# EAGLE design BMS (EAGLE 9.5.2)
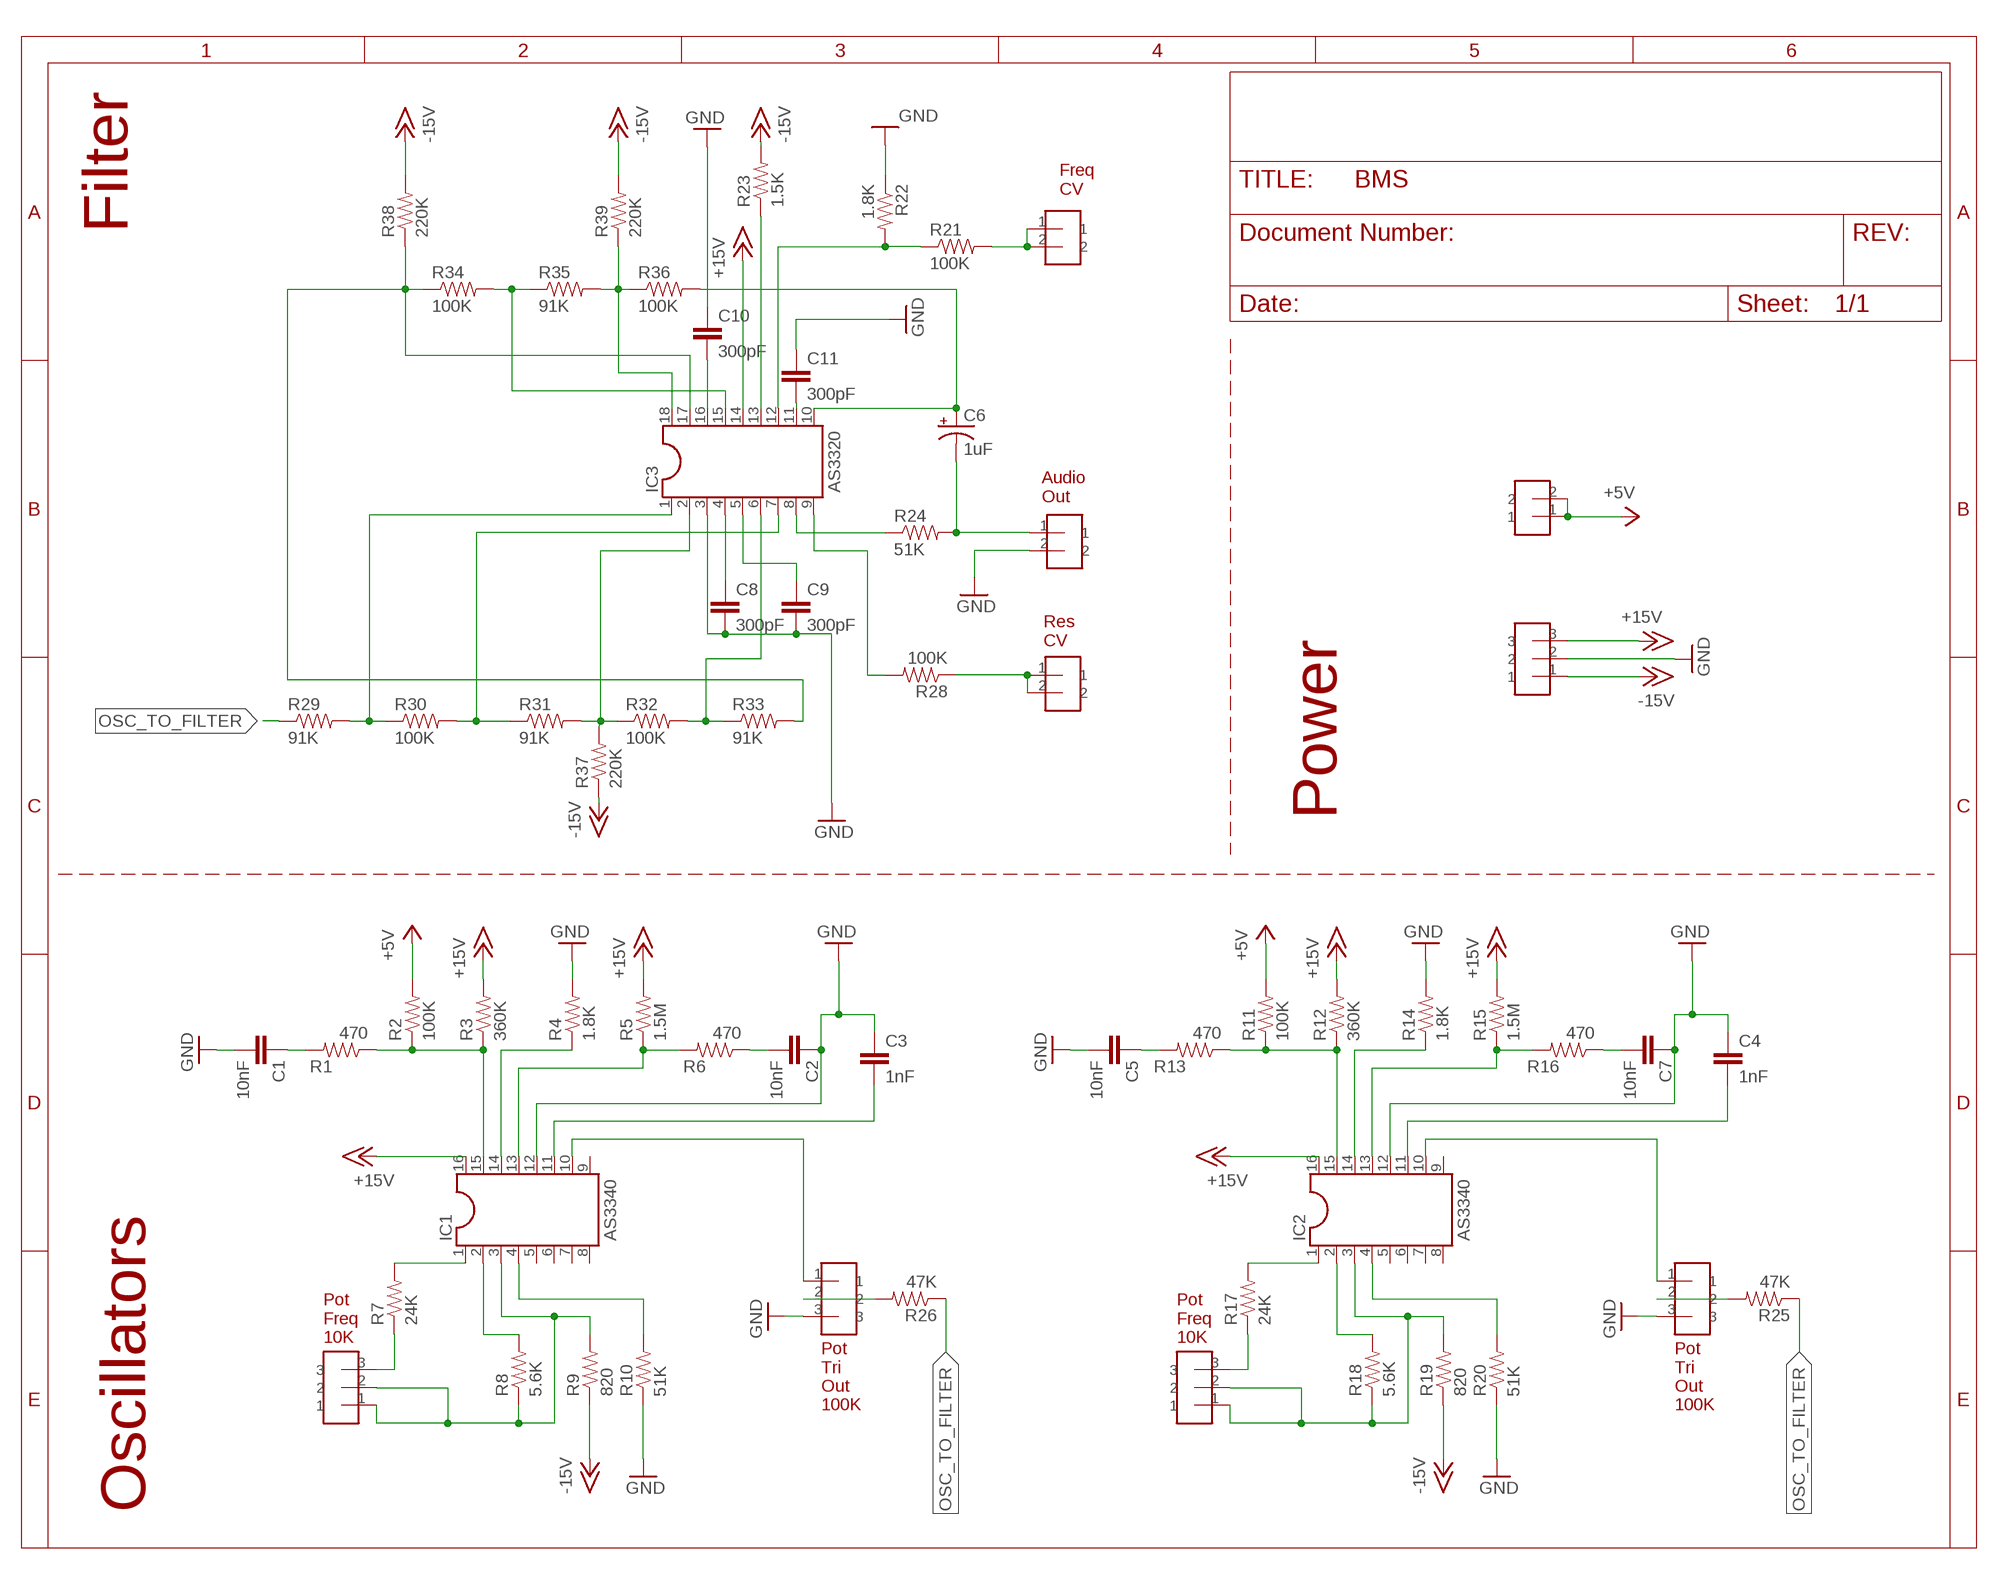
[diagram p0: schematic, sheet 1]

## Parts
C1  10nF  COMPONENT_CAP-0805  [0805]
C2  10nF  COMPONENT_CAP-0805  [0805]
C3  1nF  COMPONENT_CAP-0805  [0805]
C4  1nF  COMPONENT_CAP-0805  [0805]
C5  10nF  COMPONENT_CAP-0805  [0805]
C6  1uF  COMPONENT_CAP_POL-6.3MM  [CAP_RADIAL_CAN_10MM]
C7  10nF  COMPONENT_CAP-0805  [0805]
C8  300pF  COMPONENT_CAP-0805  [0805]
C9  300pF  COMPONENT_CAP-0805  [0805]
C10  300pF  COMPONENT_CAP-0805  [0805]
C11  300pF  COMPONENT_CAP-0805  [0805]
IC1  AS3340  DIL16S  [SOCKET-16]
IC2  AS3340  DIL16S  [SOCKET-16]
IC3  AS3320  DIL18S  [SOCKET-18]
R1  470  COMPONENT_RESISTOR-0805  [0805]
R2  100K  COMPONENT_RESISTOR-0805  [0805]
R3  360K  COMPONENT_RESISTOR-0805  [0805]
R4  1.8K  COMPONENT_RESISTOR-0805  [0805]
R5  1.5M  COMPONENT_RESISTOR-0805  [0805]
R6  470  COMPONENT_RESISTOR-0805  [0805]
R7  24K  COMPONENT_RESISTOR-0805  [0805]
R8  5.6K  COMPONENT_RESISTOR-0805  [0805]
R9  820  COMPONENT_RESISTOR-0805  [0805]
R10  51K  COMPONENT_RESISTOR-0805  [0805]
R11  100K  COMPONENT_RESISTOR-0805  [0805]
R12  360K  COMPONENT_RESISTOR-0805  [0805]
R13  470  COMPONENT_RESISTOR-0805  [0805]
R14  1.8K  COMPONENT_RESISTOR-0805  [0805]
R15  1.5M  COMPONENT_RESISTOR-0805  [0805]
R16  470  COMPONENT_RESISTOR-0805  [0805]
R17  24K  COMPONENT_RESISTOR-0805  [0805]
R18  5.6K  COMPONENT_RESISTOR-0805  [0805]
R19  820  COMPONENT_RESISTOR-0805  [0805]
R20  51K  COMPONENT_RESISTOR-0805  [0805]
R21  100K  COMPONENT_RESISTOR-0805  [0805]
R22  1.8K  COMPONENT_RESISTOR-0805  [0805]
R23  1.5K  COMPONENT_RESISTOR-0805  [0805]
R24  51K  COMPONENT_RESISTOR-0805  [0805]
R25  47K  COMPONENT_RESISTOR-0805  [0805]
R26  47K  COMPONENT_RESISTOR-0805  [0805]
R28  100K  COMPONENT_RESISTOR-0805  [0805]
R29  91K  COMPONENT_RESISTOR-0805  [0805]
R30  100K  COMPONENT_RESISTOR-0805  [0805]
R31  91K  COMPONENT_RESISTOR-0805  [0805]
R32  100K  COMPONENT_RESISTOR-0805  [0805]
R33  91K  COMPONENT_RESISTOR-0805  [0805]
R34  100K  COMPONENT_RESISTOR-0805  [0805]
R35  91K  COMPONENT_RESISTOR-0805  [0805]
R36  100K  COMPONENT_RESISTOR-0805  [0805]
R37  220K  COMPONENT_RESISTOR-0805  [0805]
R38  220K  COMPONENT_RESISTOR-0805  [0805]
R39  220K  COMPONENT_RESISTOR-0805  [0805]
U$1  HEADER-3-VERTICAL  [HEADER-3-VERTICAL]
U$2  HEADER-2-VERTICAL  [HEADER-2-VERTICAL]
U$3  HEADER-2-VERTICAL  [HEADER-2-VERTICAL]
U$4  HEADER-3-VERTICAL  [HEADER-3-VERTICAL]
U$6  HEADER-3-VERTICAL  [HEADER-3-VERTICAL]
U$8  HEADER-3-VERTICAL  [HEADER-3-VERTICAL]
U$10  HEADER-3-VERTICAL  [HEADER-3-VERTICAL]
U$13  HEADER-2-VERTICAL  [HEADER-2-VERTICAL]
U$14  HEADER-2-VERTICAL  [HEADER-2-VERTICAL]

## Nets
+5V: R2.2 R11.2 U$3.1 U$3.2
+15V: IC1.16 IC2.16 IC3.14 R3.2 R5.2 R12.2 R15.2 U$6.3
-15V: R9.1 R19.1 R23.2 R37.1 R38.2 R39.2 U$6.1
GND: C1.2 C2.1 C3.1 C4.1 C5.2 C7.1 C8.2 C9.2 C10.1 C11.1 IC1.12 IC2.12 IC3.3 R4.2 R10.1 R14.2 R20.1 R22.1 U$4.3 U$6.2 U$10.3 U$14.2
N$1: C1.1 R1.2
N$2: IC1.15 R1.1 R2.1 R3.1
N$3: IC1.14 R4.1
N$4: IC1.13 R5.1 R6.2
N$5: C2.2 R6.1
N$6: R26.2 U$4.2
N$7: C3.2 IC1.11
N$8: IC1.1 R7.2
N$9: IC1.2 R8.2
N$10: IC1.3 R8.1 R9.2 U$1.1 U$1.2
N$11: IC1.4 R10.2
N$12: IC3.13 R23.1
N$13: R21.2 U$2.1 U$2.2
N$14: R25.2 U$10.2
N$15: R7.1 U$1.3
N$17: IC1.10 U$4.1
N$18: IC3.17 R33.2 R34.1 R38.1
N$19: IC2.15 R11.1 R12.1 R13.1
N$20: IC2.14 R14.1
N$21: IC2.13 R15.1 R16.2
N$22: C7.2 R16.1
N$24: C4.2 IC2.11
N$25: C5.1 R13.2
N$26: IC2.1 R17.2
N$27: IC2.2 R18.2
N$28: IC2.3 R18.1 R19.2 U$8.1 U$8.2
N$29: IC2.4 R20.2
N$31: C9.1 IC3.5
N$33: R17.1 U$8.3
N$35: IC2.10 U$10.1
N$37: C8.1 IC3.4
N$39: C10.2 IC3.16
N$40: C11.2 IC3.11
N$42: IC3.12 R21.1 R22.2
N$47: IC3.8 R24.1
N$48: IC3.9 R28.2
N$49: R28.1 U$13.1 U$13.2
N$50: C6.- R24.2 U$14.1
N$51: C6.+ IC3.10 R36.2
N$53: IC3.1 R29.2 R30.1
N$54: IC3.7 R30.2 R31.1
N$55: IC3.2 R31.2 R32.1 R37.2
N$56: IC3.6 R32.2 R33.1
N$57: IC3.15 R34.2 R35.1
N$59: IC3.18 R35.2 R36.1 R39.1
OSC_TO_FILTER: R25.1 R26.1 R29.1
Unconnected: IC1.5 IC1.6 IC1.7 IC1.8 IC1.9 IC2.5 IC2.6 IC2.7 IC2.8 IC2.9

## Notes on the sheet
- Freq
  CV
- Filter
- Audio
  Out
- Res
  CV
- Power
- Pot
  Freq
  10K
- Pot
  Freq
  10K
- Pot 
  Tri 
  Out
  100K
- Pot 
  Tri 
  Out
  100K
- Oscillators

## Library data of the parts
C1-C5 C7-C11 = homemade-hardware:COMPONENT_CAP: Capacitor Standard 0603 ceramic capacitor, and 0.1" leaded capacitor.
C6 = homemade-hardware:COMPONENT_CAP_POL: Capacitor Polarized These are standard SMD and PTH capacitors. Normally 47uF, 100uF, and 470uF in electrolytic and tantalum varieties. Always verify the external diameter of the through hole cap, it varies with capacity, voltage, and manufacturer. The EIA devices should be standard.
IC1 IC2 = ic-package:DIL16: Dual In Line / Socket
IC3 = ic-package:DIL18: Dual In Line / Socket
R1-R26 R28-R39 = homemade-hardware:COMPONENT_RESISTOR
U$1 U$4 U$6 U$8 U$10 = homemade-hardware:HEADER-3: NPTC081KFXC-RC <https://www.digikey.com/product-detail/en/sullins-connector-solutions/NPTC081KFXC-RC/S5600-ND/776058>: Vertical Female SMD Headers TSM-110-01-T-SV <https://www.digikey.com/product-detail/en/samtec-inc/TSM-110-01-T-SV/SAM12267-ND/6691889>: Vertical Male SMD Headers M20-8890845 <https://www.digikey.com/products/en?keywords=952-3236-ND>: Horizontal Male SMD Headers M20-7910842R <https://www.digikey.com/product-detail/en/harwin-inc/M20-7910842R/952-3200-6-ND/6559341>: Horizontal Female SMD Headers
U$2 U$3 U$13 U$14 = homemade-hardware:HEADER-2: NPTC081KFXC-RC <https://www.digikey.com/product-detail/en/sullins-connector-solutions/NPTC081KFXC-RC/S5600-ND/776058>: Vertical Female SMD Headers TSM-110-01-T-SV <https://www.digikey.com/product-detail/en/samtec-inc/TSM-110-01-T-SV/SAM12267-ND/6691889>: Vertical Male SMD Headers M20-8890845 <https://www.digikey.com/products/en?keywords=952-3236-ND>: Horizontal Male SMD Headers M20-7910842R <https://www.digikey.com/product-detail/en/harwin-inc/M20-7910842R/952-3200-6-ND/6559341>: Horizontal Female SMD Headers

## Board
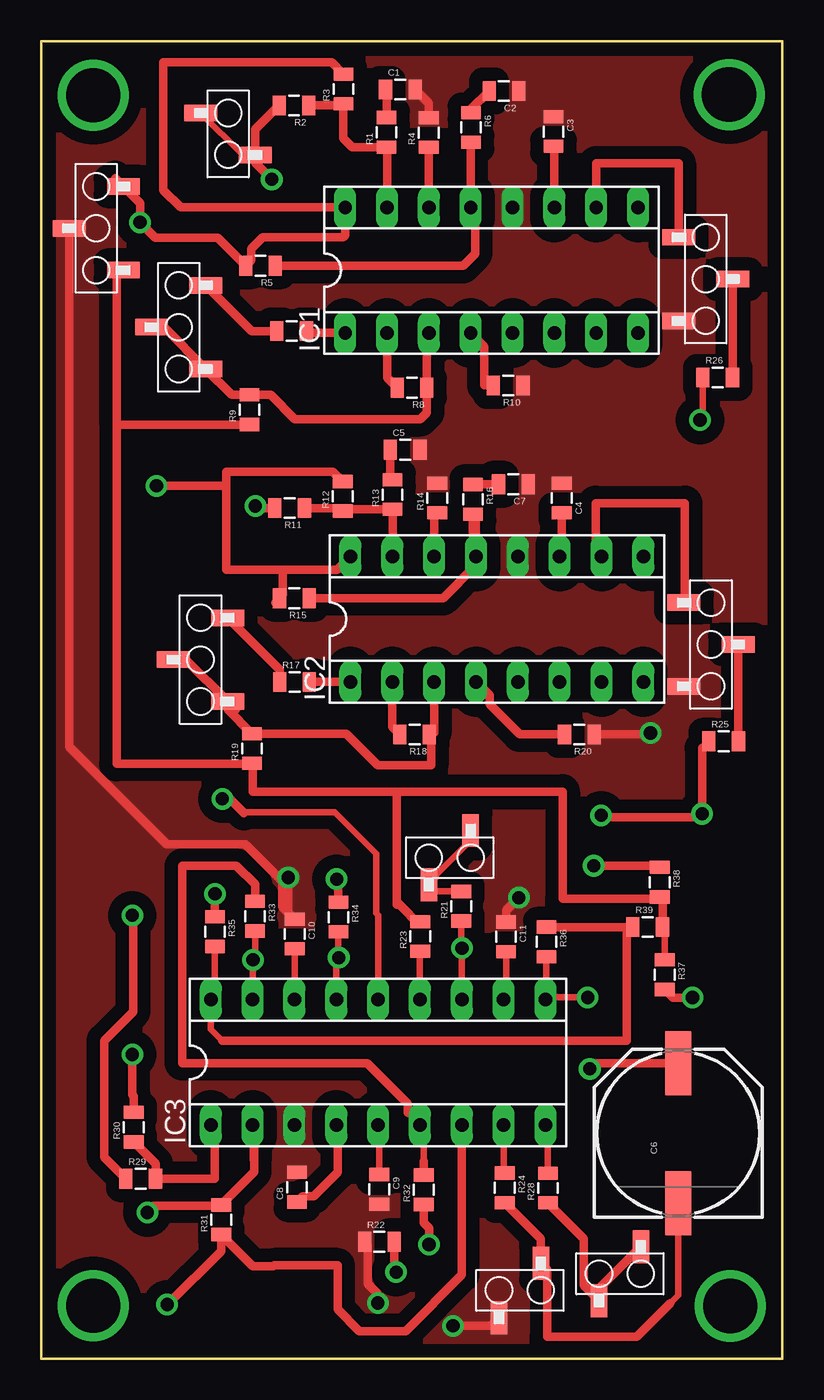
[diagram p1: board, top side]
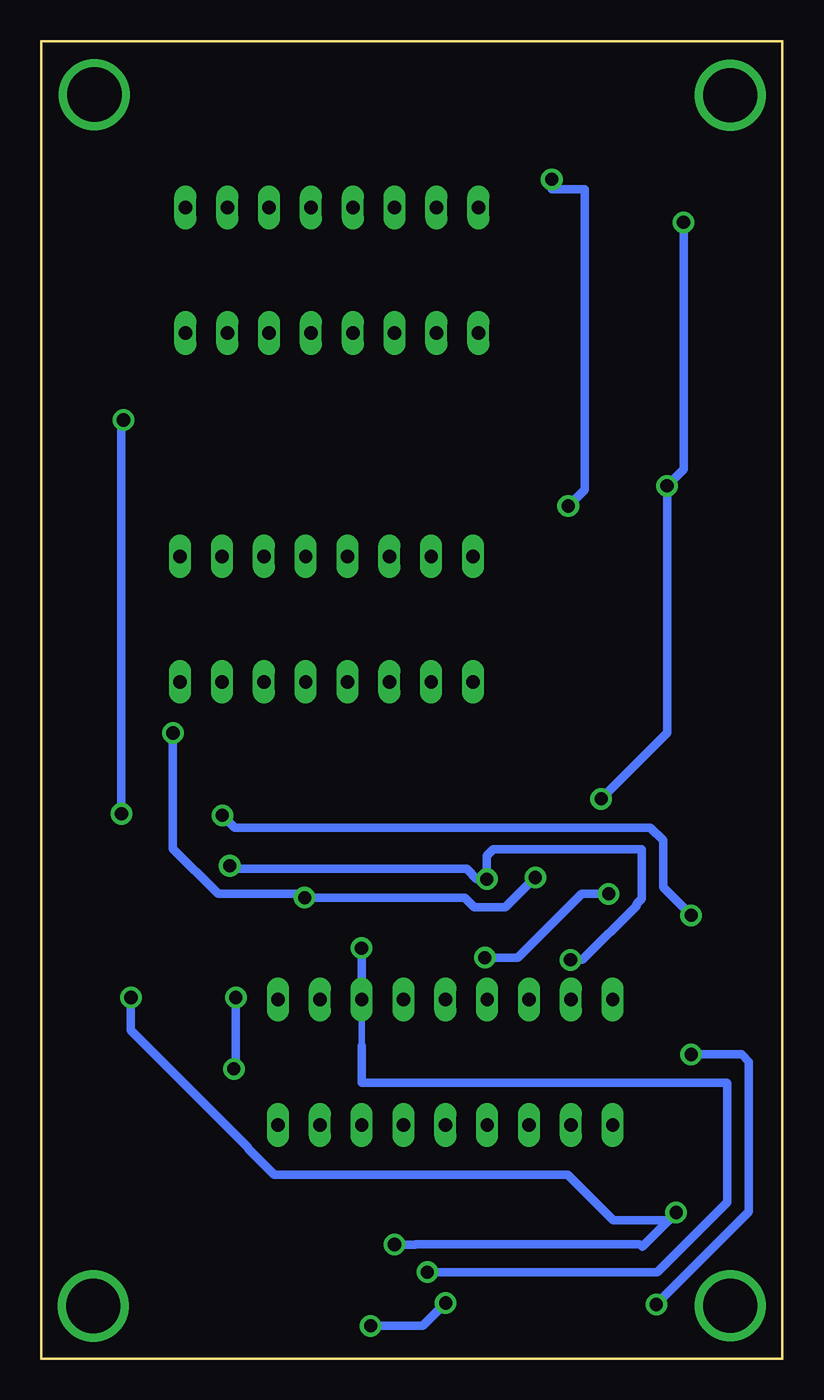
[diagram p2: board, bottom side, seen from below]

Size 45 x 80 mm. Coordinates in mm from the lower left corner, seen from the top.
Outline: 0,0 45,0 45,80 0,80 0,0
Copper layers (1*16): Top 0.035mm / dielectric 1.5mm / Bottom 0.035mm
Design rules "default": minimum track width 16mil, minimum drill 0.8mm, track to track 0.8mm, track to pad 0.8mm, pad to pad 0.8mm, via to via 0.8mm, smd to smd 0mil, copper to edge 1mil, drill to drill 1mil, minimum pad ring 10mil, minimum via ring 10mil, stop-mask expansion 1mil, vias tented up to drill 30mil, thermal gap 10mil

### Footprints (pad centres in the part's own frame; a part is rotated, then mirrored left to right if it is on the bottom)
0805 = smd 0.8 x 1.2: 1 -0.9,0; 2 0.9,0
CAP_RADIAL_CAN_10MM = smd 3.9 x 1.6: + 4.25,0; - -4.25,0
SOCKET-16 = drill 0.813 long: 1 -8.89,-3.81; 2 -6.35,-3.81; 3 -3.81,-3.81; 4 -1.27,-3.81; 5 1.27,-3.81; 6 3.81,-3.81; 7 6.35,-3.81; 8 8.89,-3.81; 9 8.89,3.81; 10 6.35,3.81; 11 3.81,3.81; 12 1.27,3.81; 13 -1.27,3.81; 14 -3.81,3.81; 15 -6.35,3.81; 16 -8.89,3.81
SOCKET-18 = drill 0.813 long: 1 -10.16,-3.81; 2 -7.62,-3.81; 3 -5.08,-3.81; 4 -2.54,-3.81; 5 0,-3.81; 6 2.54,-3.81; 7 5.08,-3.81; 8 7.62,-3.81; 9 10.16,-3.81; 10 10.16,3.81; 11 7.62,3.81; 12 5.08,3.81; 13 2.54,3.81; 14 0,3.81; 15 -2.54,3.81; 16 -5.08,3.81; 17 -7.62,3.81; 18 -10.16,3.81
HEADER-3-VERTICAL = smd 2 x 1: 1 1.65,0; 2 -1.65,2.54; 3 1.65,5.08
HEADER-2-VERTICAL = smd 2 x 1: 1 1.65,0; 2 -1.65,2.54

### Placement (x,y rotation side)
C1  21.81,77.06 0 top
C2  28.09,76.97 180 top
C3  31.1,74.51 270 top
C4  31.61,52.27 270 top
C5  22.1,55.2 0 top
C6  38.68,13.7 90 top
C7  28.67,53.1 180 top
C8  15.53,10.42 90 top
C9  20.53,10.29 270 top
C10  15.4,25.79 270 top
C11  28.22,25.62 270 top
IC1  27.35,66.1 0 top
IC2  27.67,44.91 0 top
IC3  20.46,18 0 top
R1  20.97,74.46 90 top
R2  15.35,76.1 180 top
R3  18.35,77.1 90 top
R4  23.53,74.45 90 top
R5  13.32,66.36 180 top
R6  26.09,74.76 270 top
R7  15.21,62.4 0 top
R8  22.51,58.96 180 top
R9  12.65,57.63 90 top
R10  28.35,59.1 180 top
R11  15.08,51.66 180 top
R12  18.3,52.37 90 top
R13  21.34,52.47 90 top
R14  24.05,52.27 90 top
R15  15.37,46.18 180 top
R16  26.21,52.19 270 top
R17  15.38,41.09 0 top
R18  22.67,37.91 180 top
R19  12.8,37.05 90 top
R20  32.67,37.91 180 top
R21  25.5,27.48 90 top
R22  20.54,7.1 0 top
R23  23.02,25.65 90 top
R24  28.15,10.38 270 top
R25  41.44,37.5 0 top
R26  41.08,59.59 0 top
R28  30.77,10.37 90 top
R29  6.04,10.94 0 top
R30  5.62,14.07 90 top
R31  10.93,8.44 90 top
R32  23.23,10.27 90 top
R33  12.99,26.88 270 top
R34  18.05,26.82 270 top
R35  10.55,25.94 270 top
R36  30.68,25.32 270 top
R37  37.86,23.33 270 top
R38  37.55,28.94 270 top
R39  36.82,26.22 0 top
U$1  8.35,60.1 0 top
U$2  23.54,30.43 270 top
U$3  11.35,73.1 0 top
U$4  40.35,68.1 180 top
U$6  3.35,66.1 0 top
U$8  9.67,39.91 0 top
U$10  40.67,45.91 180 top
U$13  33.87,5.17 270 top
U$14  30.34,4.16 90 top

### Tracks (layer width: path | path; a pad name or v marks a point on that pad's centre or on a via)
+5V  (via drill 0.8)
  Top 0.406: U$3.2 12.24,73.1
  Top 0.508: R2.2 13,74.65 U$3.1 | 12.24,73.1 U$3.1 | R11.2 13.12,51.66 v13,51.78 | v14,71.61 13,72.61 U$3.1
  Bottom 0.508: v13,51.78 12,52.78 12,71 14,71 v14,71.61
+15V  (via drill 0.8)
  Top 0.406: 12.22,33.23 12.3,33.23 12.34,33.19 17.81,33.19 20.34,30.66 20.34,27.04 20.46,26.92 IC3.14
  Top 0.508: R12.2 17.71,53.86 11.23,53.86 11.23,53 | IC2.16 17.97,47.91 14.67,47.91 | 11.23,53 11.23,47.91 14.67,47.91 | R5.2 12.42,66.1 | R3.2 17.64,78.71 7.42,78.71 7.42,70.95 8.46,69.91 IC1.16 18.46,68.21 18.35,68.1 13.46,68.1 12.76,67.4 12.76,66.71 R5.2 | 14.67,47.91 14.67,46.38 R15.2 14.2,45.91 | 4.49,71.68 U$6.3 6,70.17 v6,69 6.93,68.07 10.71,68.07 R5.2 | v7,53 11.23,53 | v11,34 11.45,34 12.22,33.23 12.31,33.14
  Bottom 0.508: v6,69 6,54 v7,53 7,38 v11,34
-15V
  Top 0.406: R37.1 37.86,26.09 R39.2
  Top 0.508: U$6.1 4.59,65.69 4.59,56.88 | R9.1 4.74,56.73 4.59,56.88 | 4.59,56.88 4.59,36.12 12.83,36.12 R19.1 12.86,36.09 12.86,34.44 21.6,34.44 | R39.2 37.72,27.86 R38.2 37.45,27.94 31.66,27.94 31.66,34.44 21.6,34.44 | 22.78,26.55 R23.2 22.78,26.55 21.98,27.34 21.98,27.36 21.6,27.75 | 21.6,27.56 21.6,27.75 | 21.6,27.75 21.6,34.44
GND  (via drill 0.8)
  Top 0.508: C1.2 23.53,76.25 R4.2 | U$6.2 1.7,37.16 7.61,31.24 12.39,31.24 14.64,29 14.64,27.45 C10.1 15,27.09 v15,29.23 | v20.44,3.39 20.44,3.96 19.84,4.56 19.84,6.89 R22.1 | v25,2 27.29,2 U$14.2 | C11.1 28.22,27.22 v29,28 | v37,38 36.91,37.91 R20.1
  Bottom 0.508: v20.44,3.39 21.83,2 v25,2 | v37,38 37,30.97 34.26,28.23 29.23,28.23 v29,28 19.28,28 18.69,27.41 16.81,27.41 v15,29.23
  pour Top (isolate 0.813, no thermals): -2,82 47,82 47,-2 -2,-2
N$1
  Top 0.508: R1.2 20.97,77 C1.1
N$2
  Top 0.508: IC1.15 21,73.53 R1.1 18.88,73.56 18.35,74.1 R3.1 18.25,76.1 R2.1
N$3
  Top 0.508: IC1.14 23.53,69.92 R4.1
N$4
  Top 0.508: R6.2 26.08,73.85 IC1.13 26.35,69.64 26.35,67.1 25.62,66.36 R5.1
N$5
  Top 0.508: R6.1 26.09,75.87 C2.2
N$6
  Top 0.508: U$4.2 42,59.61 R26.2
N$7
  Top 0.508: C3.2 31.16,73.55 IC1.11
N$8
  Top 0.508: IC1.1 16.24,62.29 R7.2
N$9
  Top 0.508: IC1.2 21,59.57 R8.2
N$10
  Top 0.508: IC1.3 23.41,62.16 R8.1 23.41,57.44 23.02,57.05 15.4,57.05 13.93,58.53 R9.2 11.57,58.53 U$1.1 7.46,62.64 U$1.2
N$11
  Top 0.508: IC1.4 26.91,61.46 26.91,59.1 R10.2
N$12
  Top 0.406: IC3.13 23,24.73 R23.1
N$13
  Top 0.406: U$2.1 23.96,29.2 23.96,29.36 26.08,31.47 U$2.2 | R21.2 23.94,28.38 23.77,28.54
  Top 0.508: 23.77,28.54 U$2.1
N$14
  Top 0.508: U$10.2 42.32,37.51 R25.2
N$15
  Top 0.508: U$1.3 12.78,62.4 R7.1
N$16  (via drill 3.3)
  other vias: 41.77,76.75
N$17
  Top 0.508: IC1.10 33.7,72.59 38.7,72.59 U$4.1
N$18  (via drill 0.8)
  Top 0.406: IC3.17 12.86,21.83 v12.86,24.23 12.99,24.35 R33.2
  Top 0.508: R34.1 18.05,29.02 v17.94,29.12 | v33.55,29.94 37.45,29.94 R38.1
  Bottom 0.508: v33.55,29.94 33.36,29.75 19.17,29.75 18.55,29.12 v17.94,29.12 17.94,30.55 17.55,30.94 8.55,30.94 8.55,27.94 8.84,27.64 8.84,27.52 12.14,24.23 v12.86,24.23
N$19
  Top 0.508: R11.1 18.12,51.66 R12.1 18.41,51.57 R13.1 21.34,48.74 IC2.15
N$20
  Top 0.508: IC2.14 23.86,50.91 | 23.88,50.93 23.86,50.91 | 24.12,51.3 R14.1 23.86,51.17 23.86,50.91
N$21
  Top 0.508: IC2.13 26.4,48.91 | 26.4,48.91 26.4,50.91 | IC2.13 26.4,47.64 | 26.43,51.06 R16.2 26.21,49.1 26.4,48.91 | R15.1 24.4,46.18 26.4,48.18 IC2.13
N$22
  Top 0.508: C7.2 27.76,53.09 R16.1
N$23  (via drill 3.3)
  other vias: 3.16,3.22
N$24
  Top 0.508: C4.2 31.61,48.85 IC2.11
N$25
  Top 0.508: 21.25,55.14 C5.1 21.2,53.51 R13.2
N$26
  Top 0.508: IC2.1 16.3,41.1 R17.2
N$27
  Top 0.508: IC2.2 21.32,38.36 R18.2
N$28
  Top 0.508: R18.1 23.67,37.81 | 23.67,37.81 23.67,36.04 20.44,36.04 18.53,37.95 R19.2 | 12.8,38.05 R19.2 | U$8.2 8.78,42.45 U$8.1 | U$8.1 11.81,39.42 | IC2.3 23.86,38 23.67,37.81 | U$8.1 11.32,39.43 R19.2
N$29
  Top 0.508: IC2.4 27.23,40.27 27.23,39.73 29.05,37.91 R20.2
N$30  (via drill 3.3)
  other vias: 41.83,3.21
N$31
  Top 0.406: IC3.5 20.53,14.12 C9.1
N$33
  Top 0.508: R17.1 14.48,41.83 U$8.3
N$35
  Top 0.508: IC2.10 33.67,49.07 33.67,51.95 39.08,51.95 39.08,45.97 U$10.1
N$36  (via drill 3.3)
  other vias: 3.16,76.72
N$37
  Top 0.406: 18.01,12 18.01,14.1 IC3.4
  Top 0.508: C8.1 15.87,9.87 16.56,9.87 18.01,11.31 18.01,12 18.01,14.13
N$39
  Top 0.406: C10.2 15.4,21.83 IC3.16
  Top 0.508: 15.47,24.82 C10.2
N$40
  Top 0.406: C11.2 28.22,21.95 IC3.11
N$42  (via drill 0.8)
  Top 0.406: R21.1 25.5,24.98 v25.54,24.95 | v25.54,24.95 v25.55,24.94 | IC3.12 v25.54,24.95
  Top 0.508: R22.2 21.44,5.05 21.55,4.94 v21.55,5.26
  Bottom 0.406: 25.55,19 25.55,22
  Bottom 0.508: v21.55,5.26 7.59,5.26 3.33,9.52 3.33,16.72 3.38,16.77 25.55,16.77 25.55,19 | 25.55,22 v25.55,24.94
N$47
  Top 0.406: 28.17,11.3 R24.1 28.08,11.35 IC3.8
N$48
  Top 0.406: IC3.9 30.77,14.04 R28.2
N$49
  Top 0.508: R28.1 32.93,7.3 32.93,4.45 U$13.1 33.87,4.28 U$13.2
N$50
  Top 0.406: C6.- 38.68,4.52 38.67,4.52 38.67,3.86 38.19,3.38
  Top 0.508: R24.2 30.34,7.29 U$14.1 30.71,5.43 30.71,1.35 36.16,1.35 38.19,3.38
N$51  (via drill 0.8)
  Top 0.406: R36.2 30.68,21.86 | 30.68,21.86 IC3.10 | v33.18,21.94 30.75,21.94 30.68,21.86
  Top 0.508: C6.+ 33.65,17.95 v33.31,17.61
  Bottom 0.508: v33.18,21.94 33.18,17.74 v33.31,17.61
N$53
  Top 0.406: 10.55,12 10.55,13.94 IC3.1
  Top 0.508: 10.39,14.13 10.55,13.97 10.55,12 10.55,10.94 R29.2 6.94,11.85 R30.1
N$54  (via drill 0.8)
  Top 0.508: R30.2 5.62,15.94 5.53,16.02 v5.53,18.48 | v7.65,3.3 7.69,3.3 10.93,6.54 R31.1 12.85,5.63 14.09,5.63 14.14,5.68 18,5.68 18,3 19.32,1.68 19.79,1.68 20,1.68 22.13,1.68 25.54,5.09 IC3.7
  Bottom 0.508: v7.65,3.3 2.03,8.93 2.03,17.26 2.03,17.27 2.03,18.03 2.48,18.48 v5.53,18.48
N$55  (via drill 0.8)
  Top 0.406: 12.93,12 12.84,12.09 IC3.2
  Top 0.508: 12.93,14.13 12.93,12 12.93,11.34 R31.2 10.87,9.28 6.85,9.28 v6.45,8.88 | R37.2 38.35,21.94 v39.55,21.94 | R32.1 23.23,8.26 23.55,7.94 v23.55,6.94
  Bottom 0.508: v39.55,21.94 39.55,19.94 32.42,12.81 32.42,12.76 30.86,11.19 13.03,11.19 10.26,8.42 6.85,8.42 6.85,8.88 v6.45,8.88 8.52,6.81 8.68,6.97 20,6.97 22.26,6.97 22.29,6.94 v23.55,6.94
N$56
  Top 0.406: IC3.6 23.09,14.1 | 23.09,14.1 23.23,13.96 23.23,12 | 22.26,15 23.09,14.17 23.09,14.1
  Top 0.508: 23.23,12 R32.2 | 22.26,14.95 22.26,15 22.26,15.5 19.81,17.95 8.55,17.95 8.55,29.94 11.85,29.94 12.99,28.8 R33.1
N$57  (via drill 0.8)
  Top 0.406: R34.2 18.05,24.37 | 18.05,24.37 v18.07,24.35 | IC3.15 17.92,24.25 18.05,24.37
  Top 0.508: 10.45,26.94 R35.1 v10.55,28.23
  Bottom 0.508: v18.07,24.35 16.07,24.35 12.19,28.23 v10.55,28.23
N$59
  Top 0.406: R35.2 10.55,22.06 IC3.18 10.3,20.02 11,19.32
  Top 0.508: R35.2 10.45,24.94 | R36.1 35.55,26.22 | 35.55,26.22 R39.1 | 11,19.32 35.55,19.32 35.55,26.22
OSC_TO_FILTER  (via drill 0.8)
  Top 0.406: R26.1 40.17,57.17 | R25.1 40.13,37.09
  Top 0.508: 40.17,57.17 v40,57 | 40.13,37.09 v40.13,33.09 39.91,32.87 34.13,32.87 v34,33 | R29.1 3.83,12.25 3.83,19.32 5.59,21.08 5.59,26.87 v5.53,26.92
  Bottom 0.508: v40,57 40.13,56.87 v40.13,33.09 | v34,33 33.24,32.24 8.01,32.24 7.24,31.48 7.24,28.63 v5.53,26.92